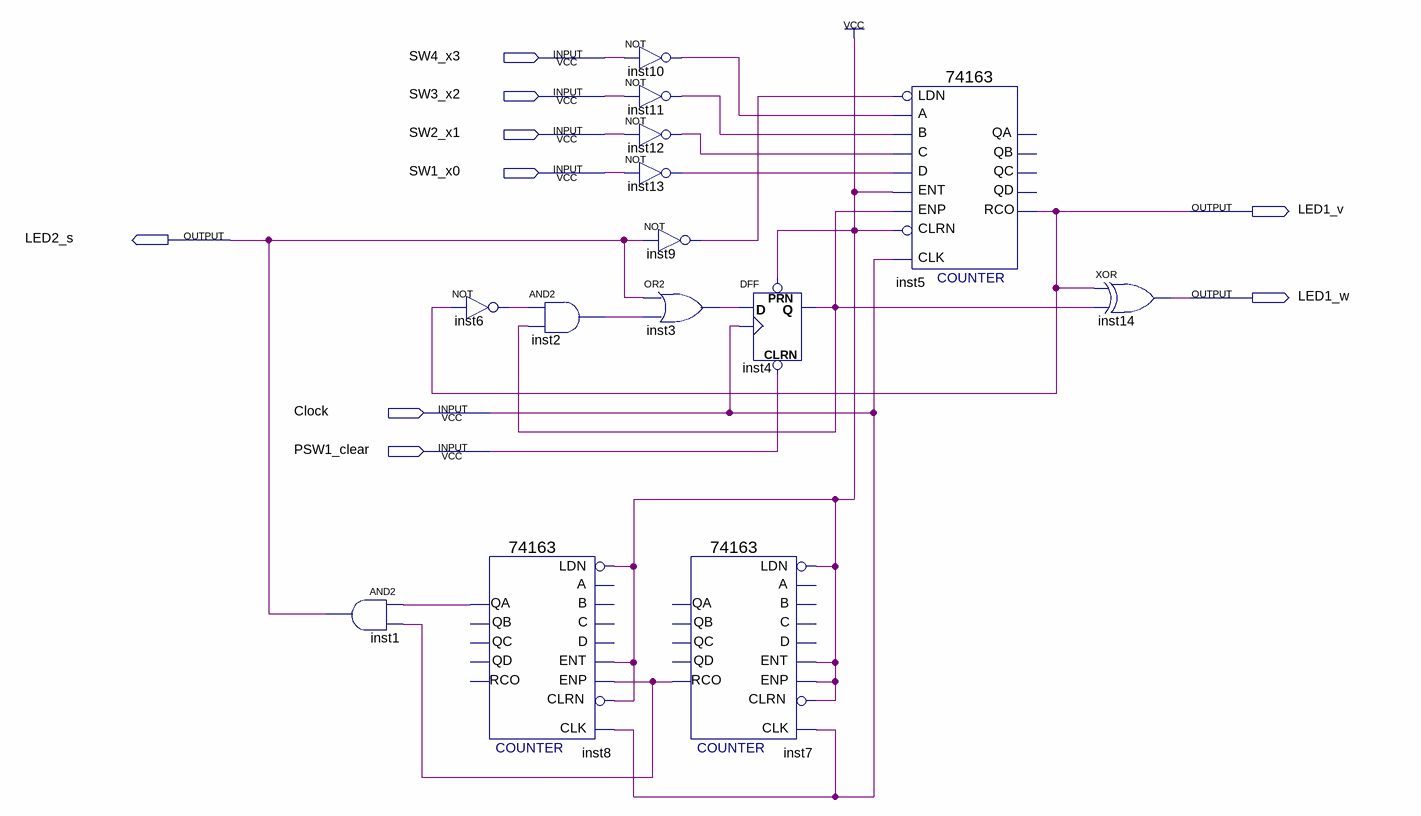
[diagram p0: schematic sheet]
// Quartus schematic q6_b.bdf as structural Verilog: 14 symbols, 9 pins
module q6_b (
  input  SW4_x3,
  input  SW3_x2,
  input  SW2_x1,
  input  SW1_x0,
  input  Clock,
  input  PSW1_clear,
  output LED1_v,
  output LED2_s,
  output LED1_w
);

  wire inst2_out, inst3_out, inst4_q, inst6_out, inst7_rco, inst8_qa, inst9_out, inst10_out, inst11_out,
       inst12_out, inst13_out;

  and inst1 (LED2_s, inst8_qa, inst7_rco);
  not inst6 (inst6_out, LED1_v);
  \74163  inst8 (
    .ENT(1'b1), .CLRN(1'b1), .CLK(Clock), .ENP(inst7_rco), .LDN(1'b1), .QA(inst8_qa));  // open: C, B, A, D, QB, QC, QD, RCO
  and inst2 (inst2_out, inst6_out, inst4_q);
  not inst10 (inst10_out, SW4_x3);
  not inst11 (inst11_out, SW3_x2);
  not inst12 (inst12_out, SW2_x1);
  not inst13 (inst13_out, SW1_x0);
  not inst9 (inst9_out, LED2_s);
  or inst3 (inst3_out, LED2_s, inst2_out);
  \74163  inst7 (
    .ENT(1'b1), .CLRN(1'b1), .CLK(Clock), .ENP(1'b1), .LDN(1'b1), .RCO(inst7_rco));  // open: C, B, A, D, QA, QB, QC, QD
  DFF inst4 (.CLRN(PSW1_clear), .CLK(Clock), .D(inst3_out), .PRN(1'b1), .Q(inst4_q));
  \74163  inst5 (
    .C(inst12_out), .B(inst11_out), .A(inst10_out), .ENT(1'b1), .D(inst13_out), .CLRN(1'b1), .CLK(Clock),
    .ENP(inst4_q), .LDN(inst9_out), .RCO(LED1_v));  // open: QA, QB, QC, QD
  xor inst14 (LED1_w, LED1_v, inst4_q);
endmodule
